# EAGLE design LoRa-Bootsmonitor_3 (EAGLE 5.07)
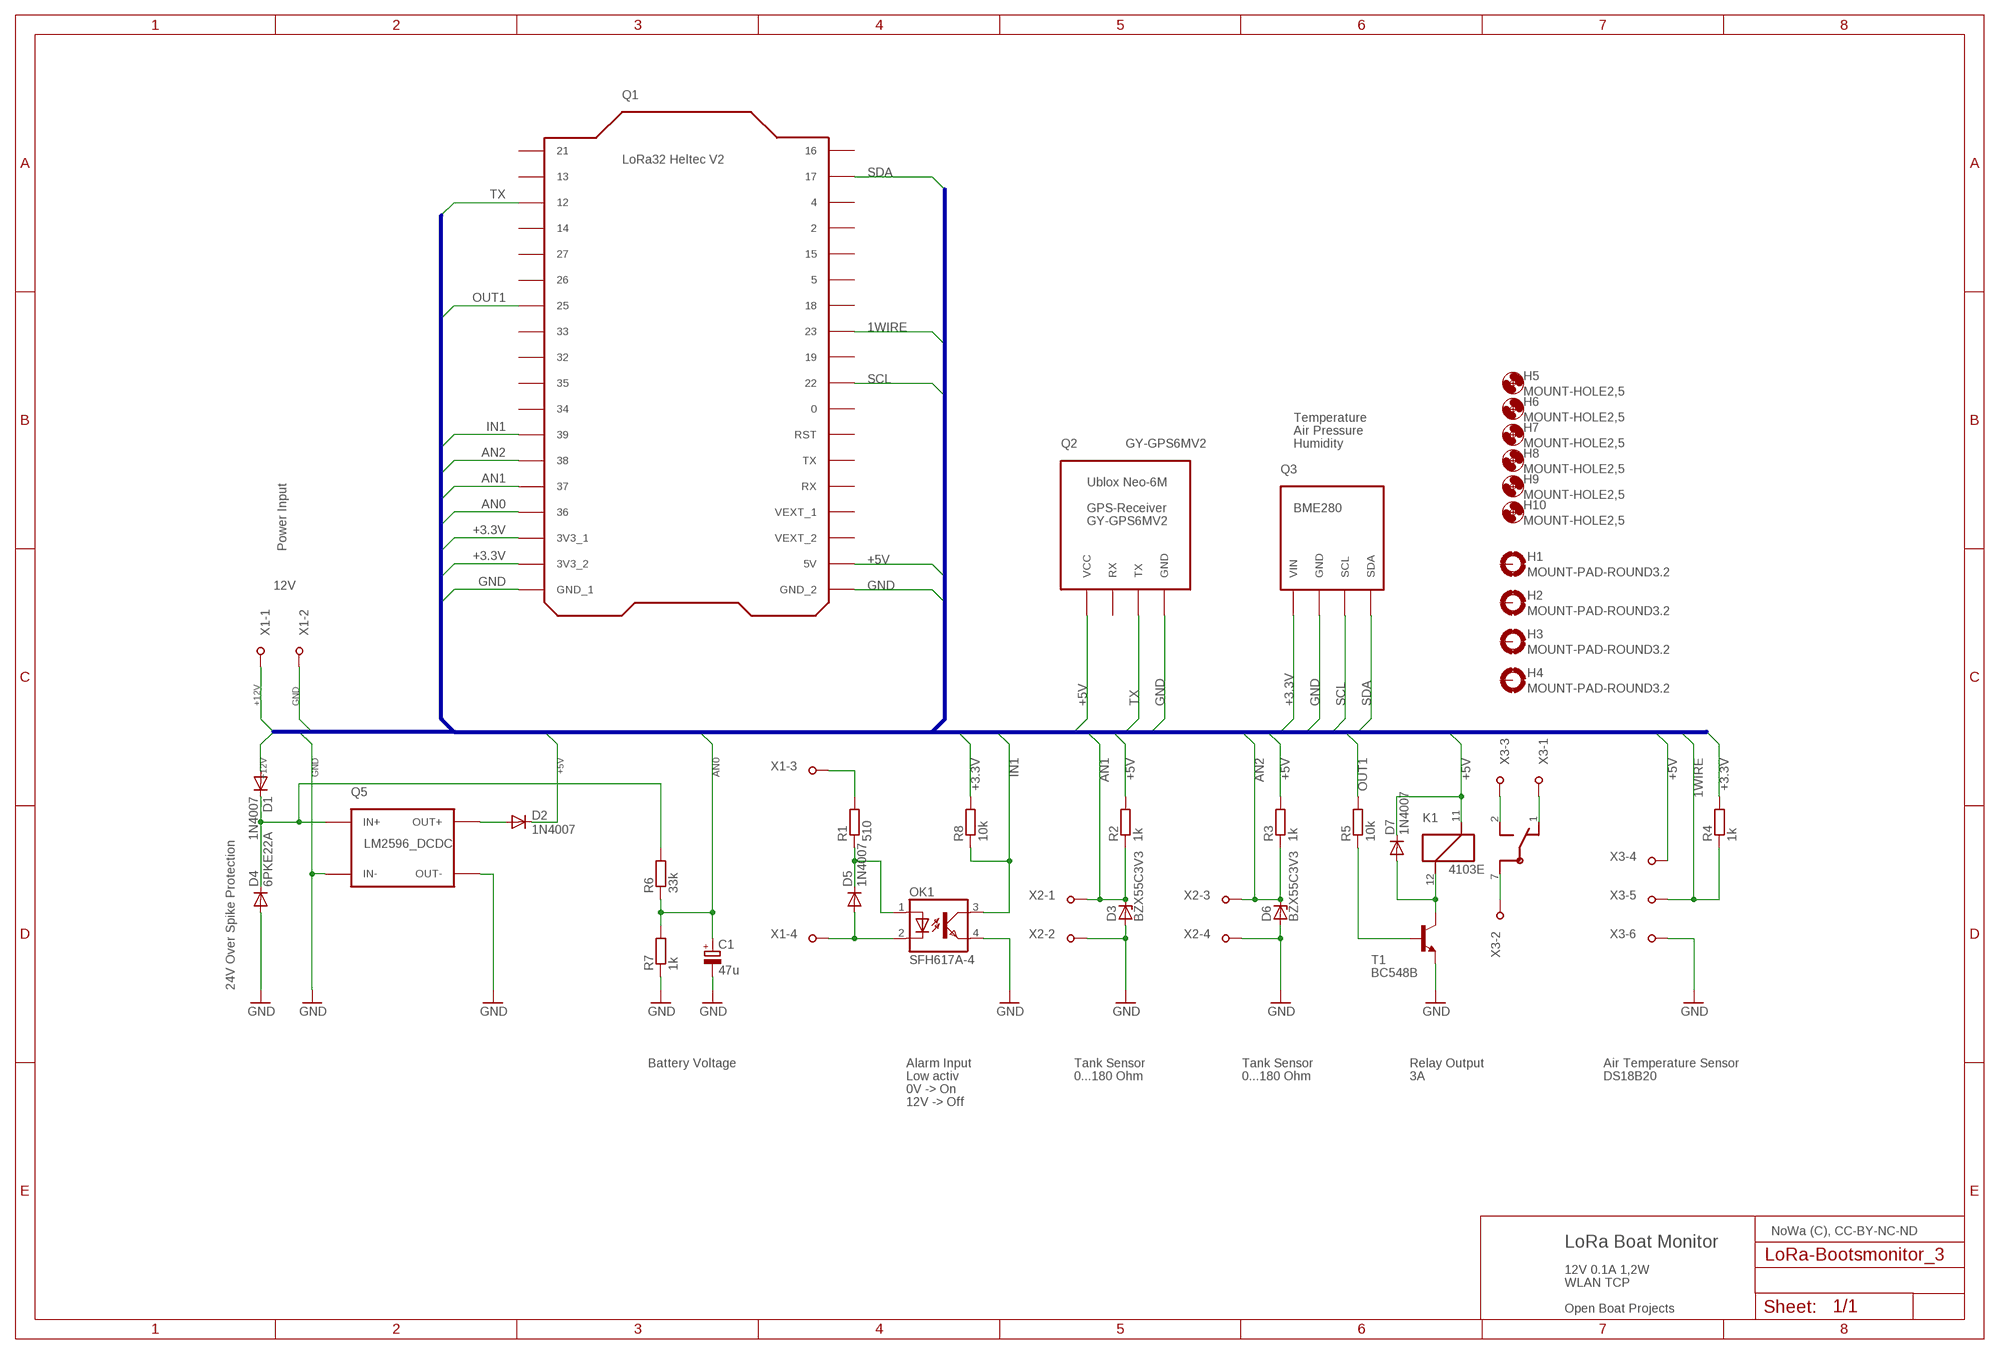
[diagram p0: schematic, sheet 1]

## Parts
C1  47u  CPOL-EUE3.5-8  [E3,5-8]
D1  1N4007  BYD13  [SOD81]
D2  1N4007  BYD13  [SOD81]
D3  BZX55C3V3  BZX55  [DO35Z10]
D4  6PKE22A  1N5400  [DO201-15]
D5  1N4007  BYD13  [SOD81]
D6  BZX55C3V3  BZX55  [DO35Z10]
D7  1N4007  BYD13  [SOD81]
H1  MOUNT-PAD-ROUND3.2  [3,2-PAD]
H2  MOUNT-PAD-ROUND3.2  [3,2-PAD]
H3  MOUNT-PAD-ROUND3.2  [3,2-PAD]
H4  MOUNT-PAD-ROUND3.2  [3,2-PAD]
H5  MOUNT-HOLE2,5  [2,5]
H6  MOUNT-HOLE2,5  [2,5]
H7  MOUNT-HOLE2,5  [2,5]
H8  MOUNT-HOLE2,5  [2,5]
H9  MOUNT-HOLE2,5  [2,5]
H10  MOUNT-HOLE2,5  [2,5]
K1  4103E  RELAIS_4102E  [RELAIS_4102E]
OK1  SFH617A-4  SFH610  [DIL04]
Q1  LORA32_HELTEC_V2  [LORA32_HELTEC_V2]
Q2  GY-GPS6MV2  GY_GPS6MV2_H  [GY_GPS6MV2_H]
Q3  BME280  [BME280]
Q5  LM2596_DCDC  [LM2596_DCDC]
R1  510  R-EU_0207/10  [0207/10]
R2  1k  R-EU_0207/10  [0207/10]
R3  1k  R-EU_0207/10  [0207/10]
R4  1k  R-EU_0207/10  [0207/10]
R5  10k  R-EU_0207/10  [0207/10]
R6  33k  R-EU_0207/10  [0207/10]
R7  1k  R-EU_0207/10  [0207/10]
R8  10k  R-EU_0207/10  [0207/10]
T1  BC548B  [TO92-EBC]
X1  AKL_092_04  [AKL_092_04]
X2  AKL_092_04  [AKL_092_04]
X3  AKL_092_06  [AKL_092_06]

## Nets
1WIRE: Q1.11 R4.1 X3.5
+3.3V: Q1.34(3V3_1) Q1.35(3V3_2) Q3.VIN R4.2 R8.2
+5V: D2.C D7.C K1.11 Q1.2(5V) Q2.VCC R2.2 R3.2 X3.4
+12V: D1.A X1.1
AN0: C1.+ Q1.33 R6.1 R7.2
AN1: D3.C Q1.32 R2.1 X2.1
AN2: D6.C Q1.31 R3.1 X2.3
GND: C1.- D3.A D4.A D6.A OK1.4(EMIT) Q1.1(GND_2) Q1.36(GND_1) Q2.GND Q3.GND Q5.IN- Q5.OUT- R7.1 T1.E X1.2 X2.2 X2.4 X3.6
IN1: OK1.3(COL) Q1.30 R8.1
N$1: R5.1 T1.B
N$2: D2.A Q5.OUT+
N$3: D7.A K1.12 T1.C
N$4: R1.2 X1.3
N$5: D5.C OK1.1(A) R1.1
N$7: D5.A OK1.2(C) X1.4
N$8: D1.C D4.C Q5.IN+ R6.2
N$10: K1.1 X3.1
N$11: K1.2 X3.3
N$12: K1.7 X3.2
OUT1: Q1.25 R5.2
SCL: Q1.9 Q3.SCL
SDA: Q1.17 Q3.SDA
TX: Q1.21 Q2.TX
Unconnected: H1.B3,2(MOUNT) H2.B3,2(MOUNT) H3.B3,2(MOUNT) H4.B3,2(MOUNT) Q1.3(VEXT_2) Q1.4(VEXT_1) Q1.5(RX) Q1.6(TX) Q1.7(RST) Q1.8 Q1.10 Q1.12 Q1.13 Q1.14 Q1.15 Q1.16 Q1.18 Q1.19 Q1.20 Q1.22 Q1.23 Q1.24 Q1.26 Q1.27 Q1.28 Q1.29 Q2.RX

## Buses
B$5

## Notes on the sheet
- Temperature
- Air Pressure
- Humidity
- Power Input
- 12V
- 24V Over Spike Protection
- Battery Voltage | Alarm Input | Tank Sensor | Tank Sensor | Relay Output | Air Temperature Sensor
- Low activ | 0...180 Ohm | 0...180 Ohm | 3A | DS18B20
- 0V -> On
- 12V -> Off
- NoWa (C), CC-BY-NC-ND
- LoRa Boat Monitor
- 12V 0.1A 1,2W
- WLAN TCP
- Open Boat Projects

## Library data of the parts
C1 = rcl:CPOL-EU: POLARIZED CAPACITOR, European symbol
D1 D2 D5 D7 = diode:BYD13: DIODE controlled avalanche rectifier
D3 D6 = diode:BZX55: Z DIODE
D4 = diode:1N5400: DIODE standard rectifier, 3 A, 50 V (Motorola)
H1-H4 = holes:MOUNT-PAD-ROUND: MOUNTING PAD, round
H5-H10 = holes:MOUNT-HOLE: MOUNTING HOLE with drill center marker
K1 = OpenPlotter:RELAIS_4102E: Relais HRJ-4102E, 3A
OK1 = optocoupler:SFH610: SIEMENS OPTO COUPLER
Q1 = OpenPlotter:LORA32_HELTEC_V2: LoRa 32 Heltec V2 LoRa transmitter and receiver with OLED and WLAN based on ESP32
Q2 = OpenPlotter:GY_GPS6MV2_H: GY-GPS6MV2 GPS Receiver Ublox Neo-6M
Q3 = OpenPlotter:BME280: BME280 Bosch sensor for temperature, humidity and air pressure
Q5 = OpenPlotter:LM2596_DCDC: LM2596 DC/DC converter board
R1-R8 = rcl:R-EU_: RESISTOR, European symbol
T1 = transistor-npn:BC548*: NPN Transistor
X1 X2 = OpenPlotter:AKL_092_04: Stacked connectors from RIACON, 4 pol, RM5, 1,5mm², 13.5A, 250/480/630V
X3 = OpenPlotter:AKL_092_06: Stacked connectors from RIACON, 6 pol, RM5, 1,5mm², 13.5A, 250/480/630V

## Board
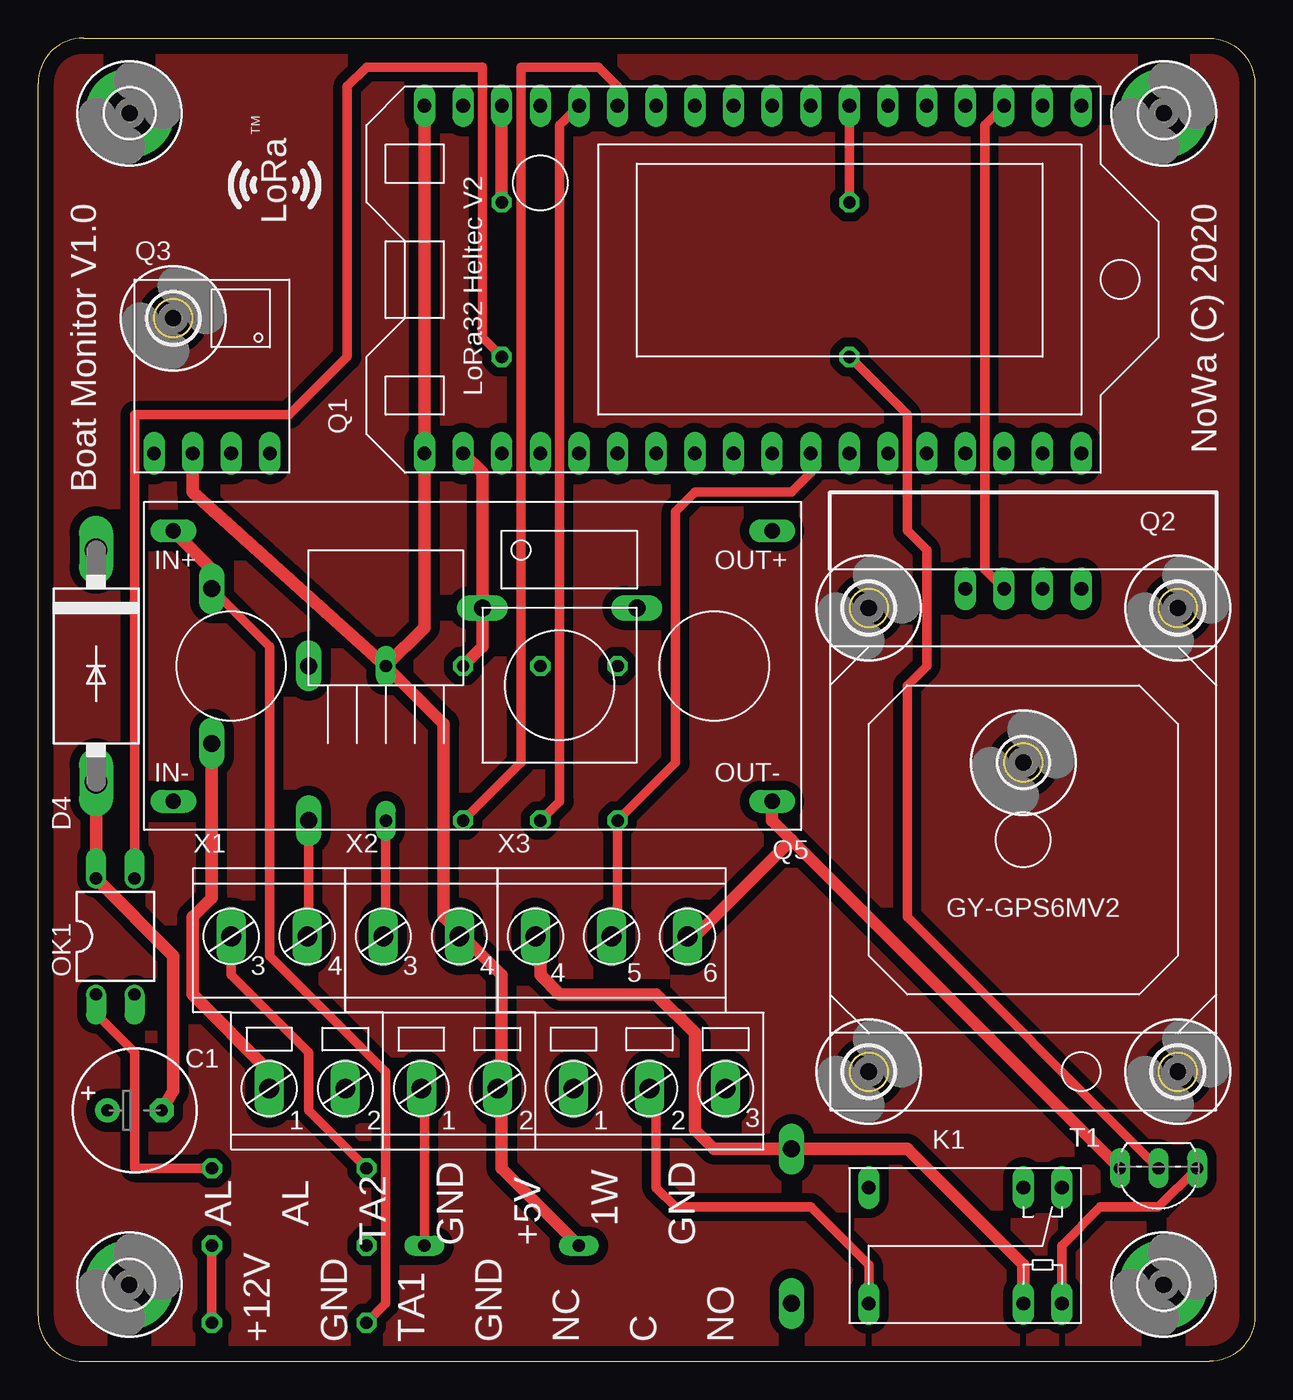
[diagram p1: board, top side]
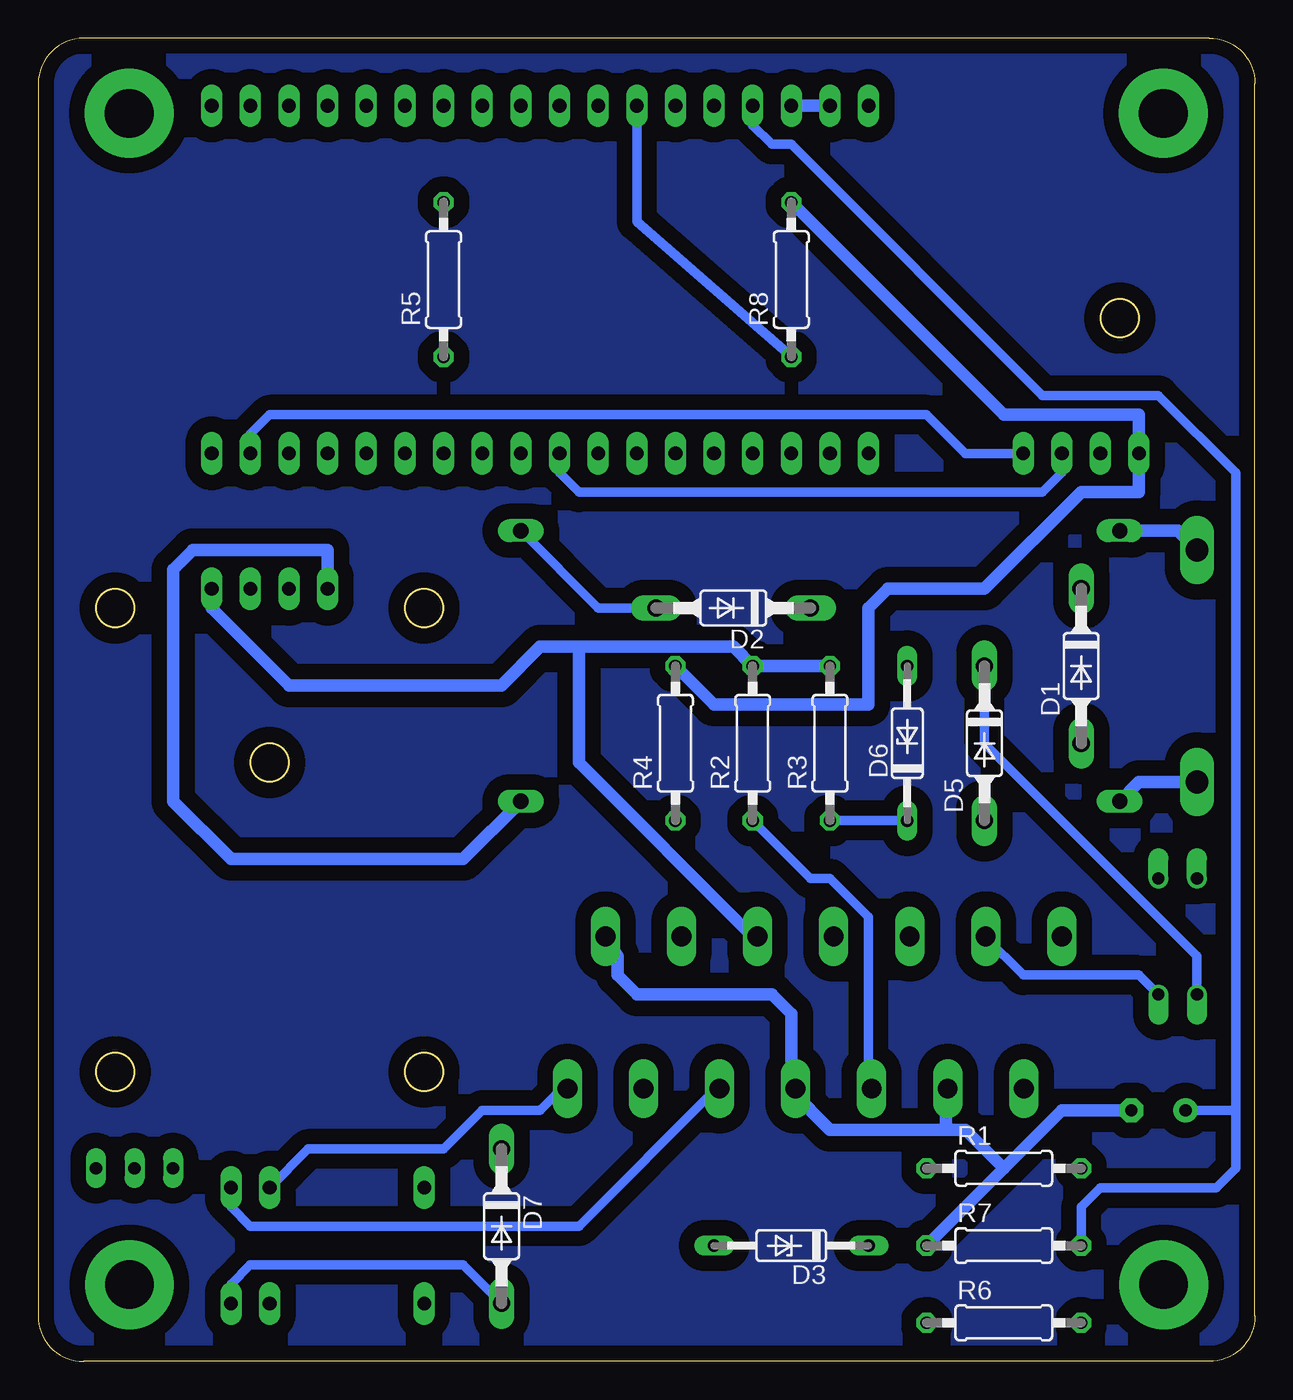
[diagram p2: board, bottom side, seen from below]

Size 80 x 87 mm. Coordinates in mm from the lower left corner, seen from the top.
Outline: 3,87 77,87 arc-88 80,84 80,3 arc-90 77,0 3,0 arc-90 0,3 0,84 arc-90 3,87
Copper layers (1*16): Top 0.035mm / dielectric 1.5mm / Bottom 0.035mm
Design rules "default": minimum track width 10mil, minimum drill 24mil, track to track 8mil, track to pad 8mil, pad to pad 8mil, via to via 8mil, smd to smd 8mil, copper to edge 40mil, drill to drill 8mil, minimum pad ring 10mil, minimum via ring 8mil, stop-mask expansion 4mil, vias tented up to drill 0mil, thermal gap 10mil

### Footprints (pad centres in the part's own frame; a part is rotated, then mirrored left to right if it is on the bottom)
E3,5-8 = drill 0.813 pad 1.6 round: + -1.778,0 | drill 0.813 pad 1.6 octagon: - 1.778,0
SOD81 = drill 1.118 long: A 5.08,0; C -5.08,0
DO35Z10 = drill 0.813 long: A 5.08,0; C -5.08,0
DO201-15 = drill 1.499 long: A 7.62,0; C -7.62,0
3,2-PAD = drill 3.2 pad 5.842 round: B3,2 0,0
RELAIS_4102E = drill 0.9 long: 1 -6.35,-3.81; 2 -3.81,-3.81; 6 6.35,-3.81; 7 6.35,3.81; 11 -3.81,3.81; 12 -6.35,3.81
DIL04 = drill 0.813 offset: 1 -1.27,-3.81; 2 1.27,-3.81; 3 1.27,3.81; 4 -1.27,3.81
LORA32_HELTEC_V2 = drill 0.9 long: 1 -11.43,22.86; 2 -11.43,20.32; 3 -11.43,17.78; 4 -11.43,15.24; 5 -11.43,12.7; 6 -11.43,10.16; 7 -11.43,7.62; 8 -11.43,5.08; 9 -11.43,2.54; 10 -11.43,0; 11 -11.43,-2.54; 12 -11.43,-5.08; 13 -11.43,-7.62; 14 -11.43,-10.16; 15 -11.43,-12.7; 16 -11.43,-15.24; 17 -11.43,-17.78; 18 -11.43,-20.32; 19 11.43,-20.32; 20 11.43,-17.78; 21 11.43,-15.24; 22 11.43,-12.7; 23 11.43,-10.16; 24 11.43,-7.62; 25 11.43,-5.08; 26 11.43,-2.54; 27 11.43,0; 28 11.43,2.54; 29 11.43,5.08; 30 11.43,7.62; 31 11.43,10.16; 32 11.43,12.7; 33 11.43,15.24; 34 11.43,17.78; 35 11.43,20.32; 36 11.43,22.86
GY_GPS6MV2_H = drill 0.9 long: GND -16.51,-3.81; RX -16.51,1.27; TX -16.51,-1.27; VCC -16.51,3.81
BME280 = drill 0.9 long: GND -1.27,-5.08; SCL 1.27,-5.08; SDA 3.81,-5.08; VIN -3.81,-5.08
LM2596_DCDC = drill 1 long: IN+ -20.32,8.89; IN- -20.32,-8.89; OUT+ 19.05,8.89; OUT- 19.05,-8.89
0207/10 = drill 0.813 octagon: 1 -5.08,0; 2 5.08,0
TO92-EBC = drill 0.813 long: B 0,-1.27; C -2.54,-1.27; E 2.54,-1.27
AKL_092_04 = drill 1.3 long: 1 2.5,-10; 2 7.5,-10; 3 0,0; 4 5,0
AKL_092_06 = drill 1.3 long: 1 2.5,-10; 2 7.5,-10; 3 12.5,-10; 4 0,0; 5 5,0; 6 10,0

### Placement (x,y rotation side)
C1  6.35,16.51 0 top
D1  11.43,45.72 270 bottom
D2  34.29,49.53 180 bottom
D3  30.48,7.62 180 bottom
D4  3.81,45.72 270 top
D5  17.78,40.64 270 bottom
D6  22.86,40.64 90 bottom
D7  49.53,8.89 270 bottom
H1  73.99,5.05 0 top
H2  6,5.05 0 top
H3  74.01,82.05 0 top
H4  6.02,82.05 0 top
H5  8.89,68.58 0 top
H6  54.61,49.53 0 top
H7  74.93,49.53 0 top
H8  54.61,19.05 0 top
H9  74.93,19.05 0 top
H10  64.77,39.37 0 top
K1  60.96,7.62 180 top
OK1  5.08,27.94 0 top
Q1  48.26,71.12 90 top
Q2  64.77,34.29 270 top
Q3  11.43,64.77 0 top
Q5  29.21,45.72 0 top
R1  16.51,12.7 180 bottom
R2  33.02,40.64 90 bottom
R3  27.94,40.64 90 bottom
R4  38.1,40.64 90 bottom
R5  53.34,71.12 90 bottom
R6  16.51,2.54 180 bottom
R7  16.51,7.62 0 bottom
R8  30.48,71.12 90 bottom
T1  73.66,11.43 180 top
X1  12.7,27.94 0 top
X2  22.7,27.94 0 top
X3  32.7,27.94 0 top

### Tracks (layer width: path | path; a pad name or v marks a point on that pad's centre or on a via)
1WIRE
  Top 0.61: X3.5 38.1,27.94 R4.1 41.91,39.37 41.91,55.88 43.18,57.15 49.53,57.15 50.8,58.42 Q1.11
+3.3V
  Top 0.813: R8.2 Q1.34
  Bottom 0.813: Q1.34 Q1.35 | R4.2 35.56,43.18 25.4,43.18 25.4,49.53 24.13,50.8 17.78,50.8 11.43,57.15 7.62,57.15 Q3.VIN 7.62,62.23 16.51,62.23 R8.2
+5V
  Top 0.813: K1.11 64.77,6.35 57.15,13.97 D7.C 44.45,13.97 43.18,15.24 43.18,21.59 40.64,24.13 34.29,24.13 33.02,25.4 33.02,26.67 X3.4 | R3.2 29.21,46.99 D2.C 29.21,58.42 Q1.2
  Bottom 0.813: R3.2 R2.2 34.29,46.99 44.45,46.99 | Q2.VCC 68.58,49.53 63.5,44.45 49.53,44.45 46.99,46.99 44.45,46.99 | 44.45,46.99 44.45,39.37 33.02,27.94 X3.4
+12V
  Top 0.813: D1.A 11.43,30.48 10.16,29.21 10.16,24.13 15.24,19.05 X1.1
AN0
  Top 0.61: R6.1 R7.2
  Bottom 0.61: Q1.33 33.02,81.28 31.75,80.01 30.48,80.01 13.97,63.5 6.35,63.5 1.27,58.42 1.27,16.51 | 1.27,16.51 C1.+ | R7.2 11.43,10.16 10.16,11.43 2.54,11.43 1.27,12.7 1.27,16.51
AN1
  Top 0.61: D3.C 25.4,17.78 X2.1 | Q1.32 34.29,81.28 34.29,36.83 R2.1
  Bottom 0.61: R2.1 29.21,31.75 27.94,31.75 25.4,29.21 25.4,19.05 X2.1
AN2
  Top 0.61: Q1.31 38.1,83.82 36.83,85.09 31.75,85.09 31.75,39.37 R3.1 | D6.C 22.86,27.94 X2.3
  Bottom 0.61: D6.C R3.1
GND
  Top 0.254: X3.6 43.18,27.94 | 27.94,27.94 X2.4
  Top 0.813: 49.53,34.29 48.26,35.56 Q5.OUT- | 49.53,34.29 T1.E | 43.18,27.94 49.53,34.29 | D6.A 25.4,48.26 Q1.1 Q1.36 | D6.A 10.16,57.15 Q3.GND | D3.A 30.48,12.7 30.48,17.78 X2.2 30.48,19.05 30.48,25.4 27.94,27.94 26.67,29.21 26.67,41.91 D6.A | D4.A OK1.4 8.89,26.67 8.89,17.78 C1.-
  Bottom 0.813: Q2.GND 60.96,53.34 69.85,53.34 71.12,52.07 71.12,36.83 67.31,33.02 52.07,33.02 Q5.OUT- | Q5.IN- 7.62,38.1 D4.A | 16.51,12.7 12.7,16.51 C1.- | 16.51,12.7 R7.1 | 20.32,15.24 19.05,15.24 16.51,12.7 | 20.32,15.24 20.32,17.78 X1.2 | 20.32,15.24 27.94,15.24 30.48,17.78 X2.2 30.48,19.05 30.48,22.86 31.75,24.13 40.64,24.13 41.91,25.4 41.91,26.67 X3.6
IN1
  Top 0.61: OK1.3 6.35,62.23 16.51,62.23 20.32,66.04 20.32,83.82 21.59,85.09 29.21,85.09 29.21,67.31 R8.1
  Bottom 0.61: Q1.30 40.64,74.93 R8.1
N$1
  Top 0.61: T1.B 57.15,29.21 57.15,44.45 58.42,45.72 58.42,53.34 57.15,54.61 57.15,62.23 R5.1
N$2
  Bottom 0.61: Q5.OUT+ 43.18,49.53 D2.A
N$3
  Top 0.61: K1.12 67.31,7.62 69.85,10.16 73.66,10.16 T1.C
  Bottom 0.61: D7.A 52.07,6.35 66.04,6.35 67.31,5.08 K1.12
N$4
  Top 0.61: R1.2 17.78,16.51 17.78,20.32 12.7,25.4 X1.3
N$5
  Top 0.254: 3.81,22.86 OK1.1
  Top 0.61: R1.1 6.35,12.7 6.35,20.32 3.81,22.86
  Bottom 0.61: D5.C 17.78,40.64 3.81,26.67 OK1.1
N$6
  pour Top (isolate 0.61): 1.27,86.36 78.74,86.36 78.74,1.27 1.27,1.27
N$7
  Top 0.254: X1.4 17.78,27.94
  Top 0.61: 17.78,27.94 D5.A
  Bottom 0.254: 17.78,27.94 X1.4
  Bottom 0.61: OK1.2 7.62,25.4 15.24,25.4 17.78,27.94
N$8
  Top 0.61: R6.2 22.86,3.81 22.86,19.05 15.24,26.67 15.24,46.99 D1.C
  Top 0.813: Q5.IN+ 11.43,52.07 D1.C
  Bottom 0.813: D4.C 5.08,54.61 Q5.IN+
N$9
  pour Bottom (isolate 1.016): 1.27,86.36 78.74,86.36 78.74,1.27 1.27,1.27
N$10
  Bottom 0.61: K1.1 67.31,10.16 66.04,8.89 44.45,8.89 35.56,17.78 X3.1
N$11
  Bottom 0.61: K1.2 62.23,13.97 53.34,13.97 50.8,16.51 46.99,16.51 45.72,17.78 X3.3
N$12
  Top 0.61: K1.7 54.61,6.35 50.8,10.16 41.91,10.16 40.64,11.43 40.64,17.78 X3.2
OUT1
  Top 0.61: R5.2 Q1.25
SCL
  Bottom 0.61: Q3.SCL 12.7,58.42 13.97,57.15 44.45,57.15 45.72,58.42 Q1.9
SDA
  Bottom 0.61: Q3.SDA 19.05,59.69 21.59,62.23 64.77,62.23 66.04,60.96 Q1.17
TX
  Top 0.61: Q2.TX 62.23,52.07 62.23,81.28 Q1.21

### Text on the board
tPlace: TM | LoRa | NoWa (C) 2020 | Boat Monitor V1.0 | GY-GPS6MV2 | AL | AL | 1W | TA2 | GND | +5V | GND | +12V | GND | TA1 | GND | NC | C | NO